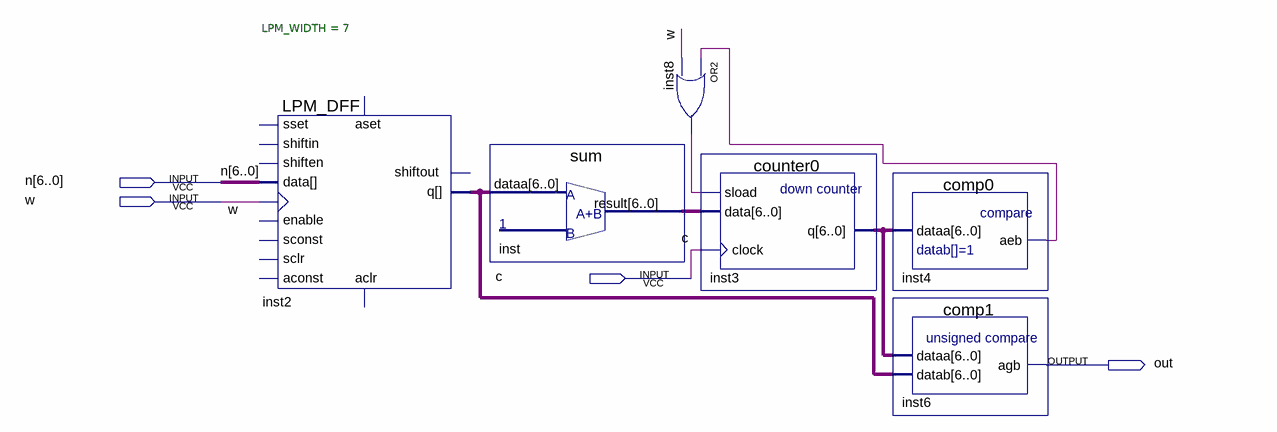
[diagram p0: schematic sheet]
// Quartus schematic 7.bdf as structural Verilog: 6 symbols, 4 pins
module \7  (
  input  [6:0] n,
  input  w,
  input  c,
  output out
);

  wire inst4_aeb, inst8_out;
  wire [6:0] inst2_q, inst3_q, inst_result;

  LPM_DFF #(.LPM_WIDTH(7)) inst2 (
    .clock(w), .data(n), .q(inst2_q));  // open: shiftin, shiften, enable, aconst, sclr, sconst, sset, aset, aclr, shiftout
  sum inst (.dataa(inst2_q), .result(inst_result));
  or inst8 (inst8_out, inst4_aeb, w);
  counter0 inst3 (.sload(inst8_out), .data(inst_result), .clock(c), .q(inst3_q));
  comp0 inst4 (.dataa(inst3_q), .aeb(inst4_aeb));
  comp1 inst6 (.dataa(inst3_q), .datab(inst2_q), .agb(out));
endmodule
